# EAGLE design ds1820 breakout (EAGLE 7.2.0)
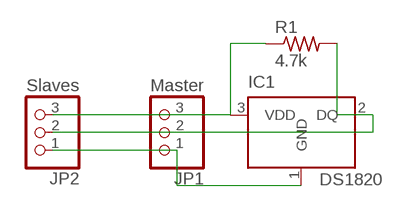
[diagram p0: schematic, sheet 1]

## Parts
IC1  DS1820  [TO-92]
JP1  Master  PINHD-1X3  [1X03]
JP2  Slaves  PINHD-1X3  [1X03]
R1  4.7k  R-US_0207/7  [0207/7]

## Nets
GND: IC1.1(GND) JP1.1 JP2.1
N$2: IC1.2(DQ) JP1.2 JP2.2 R1.2
VCC: IC1.3(VDD) JP1.3 JP2.3 R1.1

## Library data of the parts
IC1 = DS1820:DS1820: DS1820 - 1-Wire Digital Thermometer
JP1 JP2 = adafruit:PINHD-1X3: PIN HEADER
R1 = resistor:R-US_: RESISTOR, American symbol

## Board
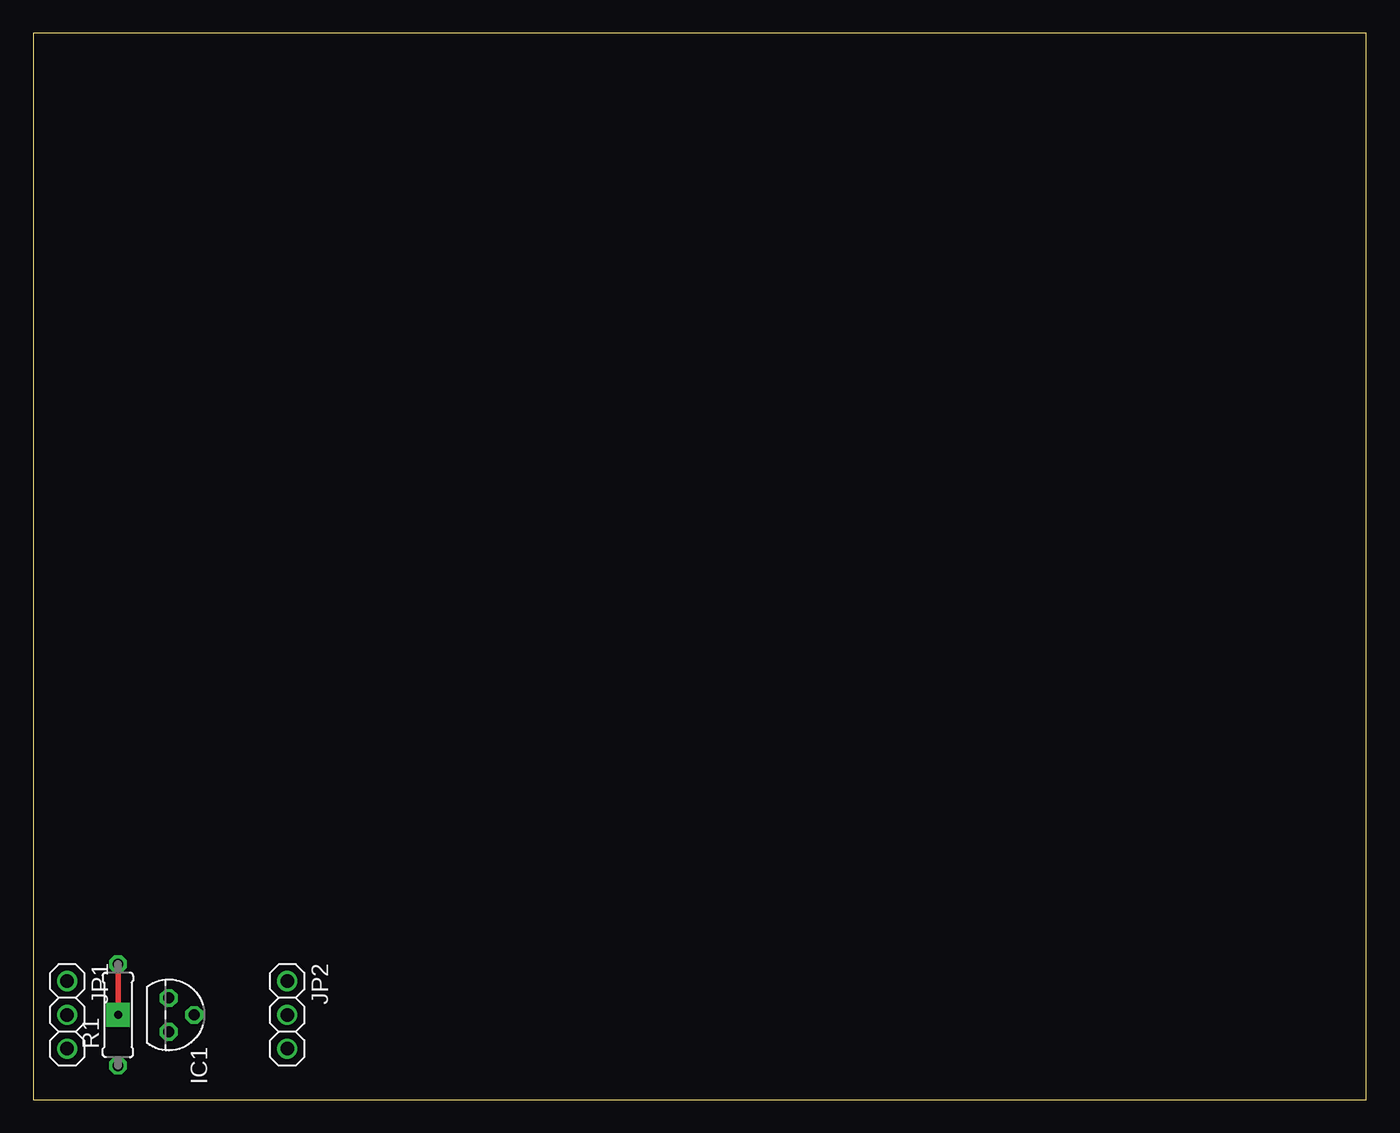
[diagram p1: board, top side]
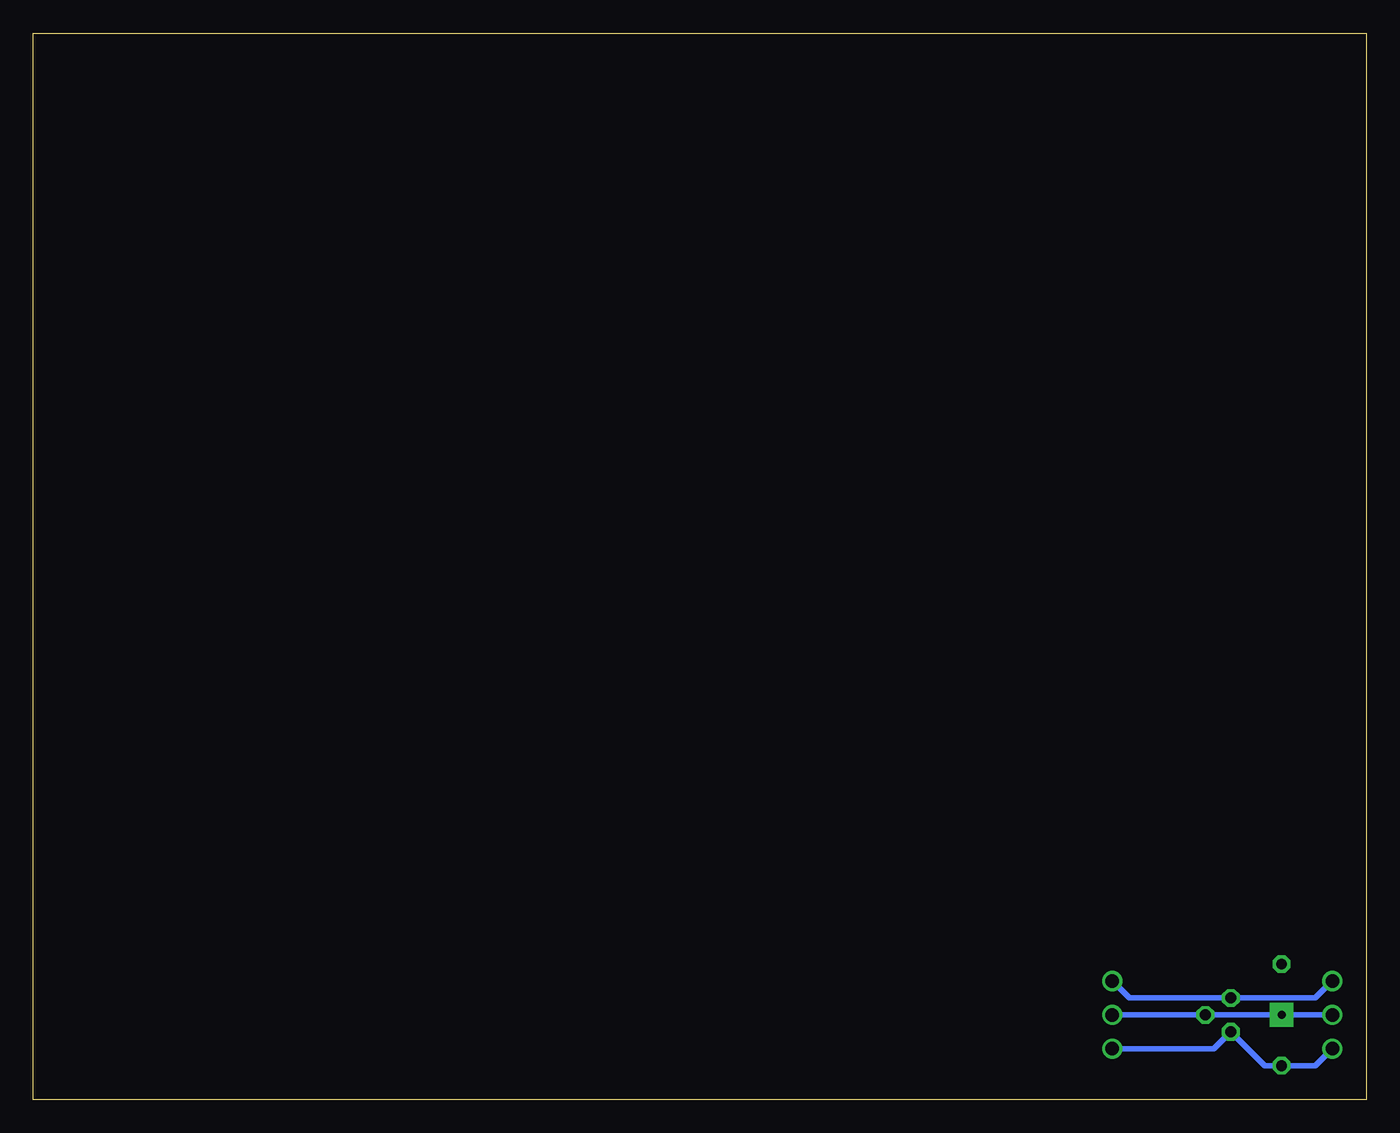
[diagram p2: board, bottom side, seen from below]

Size 100 x 80 mm. Coordinates in mm from the lower left corner, seen from the top.
Outline: 0,0 100,0 100,80 0,80 0,0
Copper layers (1*16): Top 0.035mm / dielectric 1.5mm / Bottom 0.035mm
Design rules "default": minimum track width 10mil, minimum drill 24mil, track to track 8mil, track to pad 8mil, pad to pad 8mil, via to via 8mil, smd to smd 8mil, copper to edge 40mil, drill to drill 8mil, minimum pad ring 10mil, minimum via ring 8mil, stop-mask expansion 4mil, vias tented up to drill 0mil, thermal gap 10mil

### Footprints (pad centres in the part's own frame; a part is rotated, then mirrored left to right if it is on the bottom)
TO-92 = drill 0.813 pad 1.27 octagon: 1 -1.27,0; 2 0,1.905; 3 1.27,0
1X03 = drill 1.016: 1 -2.54,0; 2 0,0; 3 2.54,0
0207/7 = drill 0.813 octagon: 1 -3.81,0; 2 3.81,0

### Placement (x,y rotation side)
IC1  10.16,6.35 270 top
JP1  2.54,6.35 270 top
JP2  19.05,6.35 270 top
R1  6.35,6.35 90 top

### Tracks (layer width: path | path; a pad name or v marks a point on that pad's centre or on a via)
GND
  Bottom 0.406: JP1.1 3.81,7.62 IC1.1 17.78,7.62 JP2.1
N$2  (via drill 0.6 pad 1.78)
  Top 0.406: R1.2 v6.35,6.35
  Bottom 0.406: JP2.2 IC1.2 v6.35,6.35 JP1.2
VCC
  Bottom 0.406: JP1.3 3.81,2.54 R1.1 7.62,2.54 IC1.3 11.43,3.81 JP2.3